# EAGLE design insect-robot (EAGLE 7.7.0)
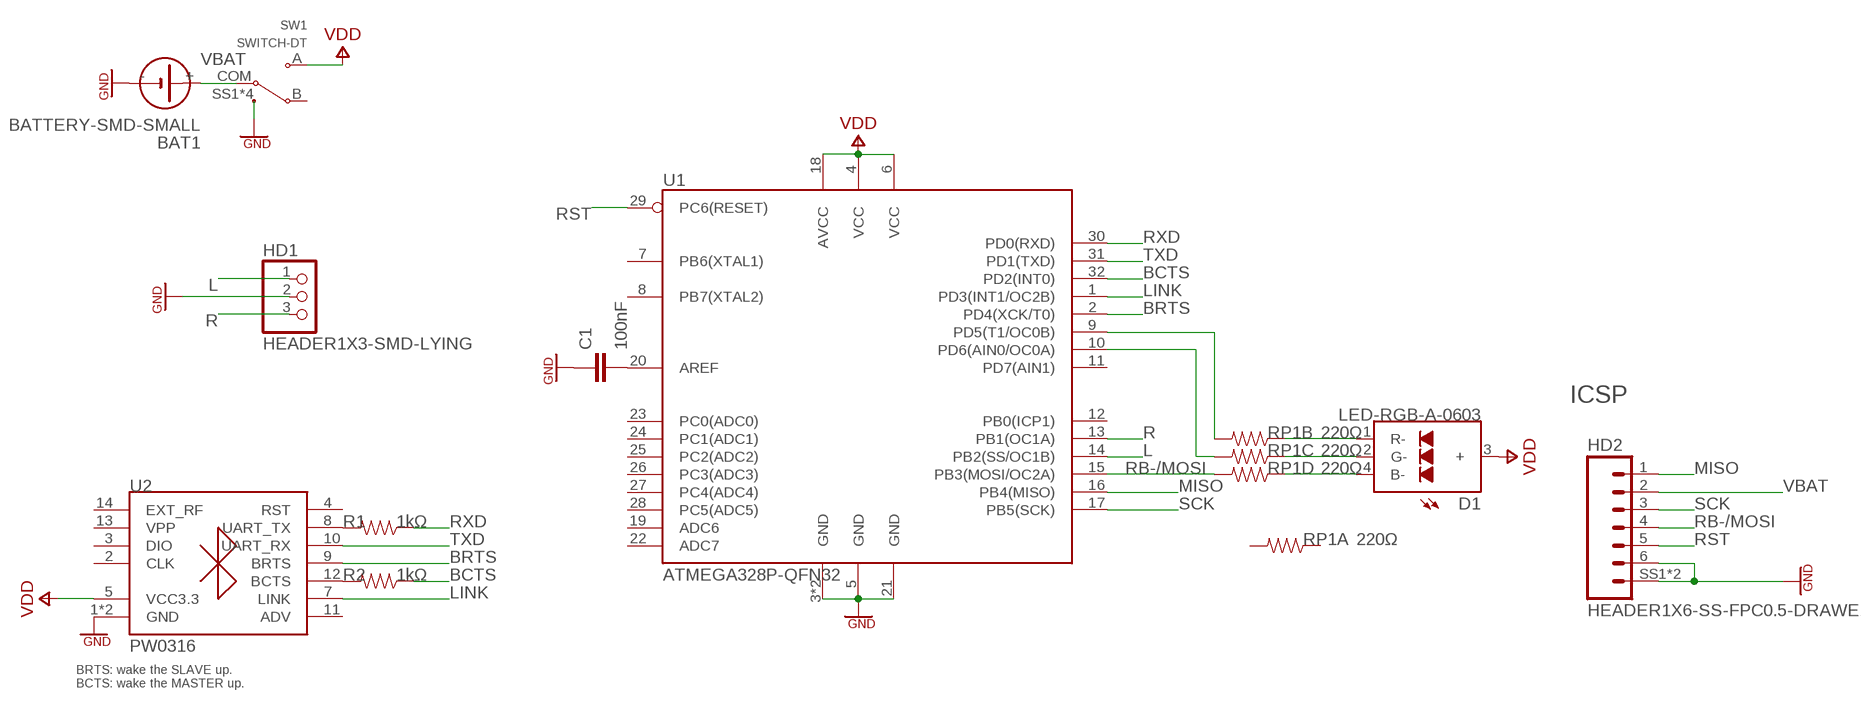
[diagram p0: schematic, sheet 1]

## Parts
BAT1  BATTERY-SMD-SMALL  [BAT-SMD-SMALL]
C1  100nF  CAP-0603  [SMD0603]
D1  LED-RGB-A-0603  [LED-0603X2]
HD1  HEADER1X3-SMD-LYING  [SMD-1X3-LYING]
HD2  HEADER1X6-SS-FPC0.5-DRAWER  [FPC0.5-6-DRAWER]
R1  1kΩ  RES-0603  [SMD0603]
R2  1kΩ  RES-0603  [SMD0603]
RP1  220Ω  RP-0603  [RP0603]
SW1  SWITCH-DT  [SWITCH-SMD-6.7X2.7]
U1  ATMEGA328P-QFN32  [QFN32]
U2  PW0316  [PW0316]

## Nets
AREF: C1.2 U1.20(AREF)
B-: D1.4(B-) RP1.7
BCTS: R2.1 U1.32(PD2(INT0))
BRTS: U1.2(PD4(XCK/T0)) U2.9(BRTS)
G-: D1.2(G-) RP1.5
GND: BAT1.- C1.1 HD1.2 HD2.6 HD2.SS1 HD2.SS2 SW1.SS1(SS) SW1.SS2(SS) SW1.SS3(SS) SW1.SS4(SS) U1.3(GND) U1.5(GND) U1.21(GND) U1.EP(GND) U2.1(GND) U2.6(GND)
L: HD1.1 U1.14(PB2(SS/OC1B))
LINK: U1.1(PD3(INT1/OC2B)) U2.7(LINK)
MISO: HD2.1 U1.16(PB4(MISO))
R: HD1.3 U1.13(PB1(OC1A))
R-: D1.1(R-) RP1.3
R-BCTS: R2.2 U2.12(BCTS)
R-TX: R1.2 U2.8(UART_TX)
RB-/MOSI: HD2.4 RP1.8 U1.15(PB3(MOSI/OC2A))
RG-: RP1.6 U1.10(PD6(AIN0/OC0A))
RR-: RP1.4 U1.9(PD5(T1/OC0B))
RST: HD2.5 U1.29(PC6(RESET))
RXD: R1.1 U1.30(PD0(RXD))
SCK: HD2.3 U1.17(PB5(SCK))
TXD: U1.31(PD1(TXD)) U2.10(UART_RX)
VBAT: BAT1.+ HD2.2 SW1.COM
VDD: D1.3(+) SW1.A U1.4(VCC) U1.6(VCC) U1.18(AVCC) U2.5(VCC3.3)
Unconnected: RP1.1 RP1.2 SW1.B U1.7(PB6(XTAL1)) U1.8(PB7(XTAL2)) U1.11(PD7(AIN1)) U1.12(PB0(ICP1)) U1.19(ADC6) U1.22(ADC7) U1.23(PC0(ADC0)) U1.24(PC1(ADC1)) U1.25(PC2(ADC2)) U1.26(PC3(ADC3)) U1.27(PC4(ADC4)) U1.28(PC5(ADC5)) U2.2(CLK) U2.3(DIO) U2.4(RST) U2.11(ADV) U2.13(VPP) U2.14(EXT_RF)

## Notes on the sheet
- ICSP
- BRTS: wake the SLAVE up.
  BCTS: wake the MASTER up.

## Library data of the parts
BAT1 = MyLibrary:BATTERY: Battery port
C1 = MyLibrary:CAP: Non-polarized capacitor
D1 = MyLibrary:LED-RGB-A: Common Anode
HD1 = MyLibrary:HEADER1X3
HD2 = MyLibrary:HEADER1X6-SS: 6-pin Header (1*6) 0.5mm Pitch Connectors For FPC/FFC
R1 R2 = MyLibrary:RES: Resistor
RP1 = MyLibrary:RP: Resistor Packs
SW1 = MyLibrary:SWITCH-DT
U1 = MyLibrary:ATMEGA328P: Atmel 32-pin 8-bit AVR microcontroller
U2 = MyLibrary:PW0316: BCTS: data arrived signal, uses for wake up the master; BRTS: data send request, uses for wake up this module.

## Board
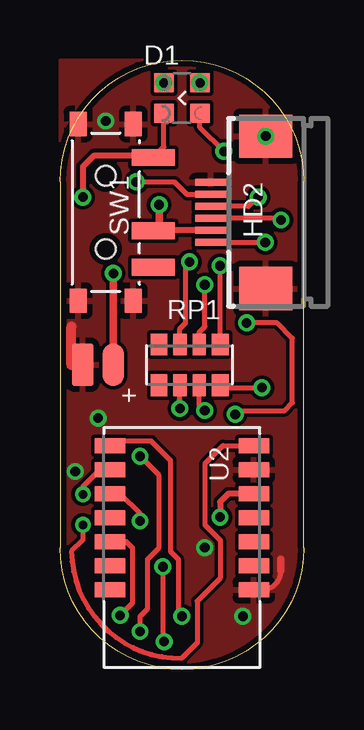
[diagram p1: board, top side]
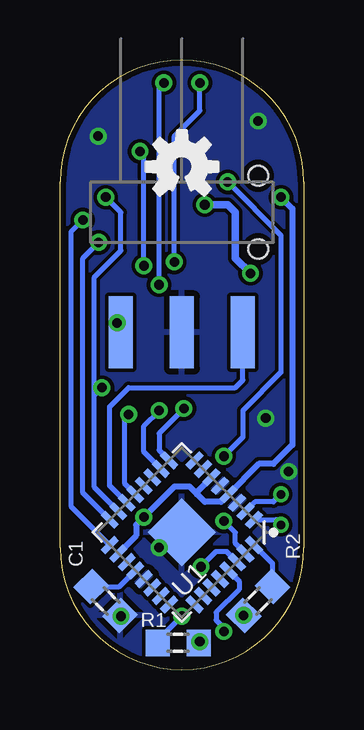
[diagram p2: board, bottom side, seen from below]

Size 10.16 x 25.4 mm. Coordinates in mm from the lower left corner, seen from the top.
Outline: 10.16,5.08 10.16,20.32 arc90 5.08,25.4 arc90 0,20.32 0,5.08 arc90 5.08,0 arc90 10.16,5.08
Copper layers (1*16): Top 0.035mm / dielectric 1.5mm / Bottom 0.035mm
Design rules "seeedStudio": minimum track width 6mil, minimum drill 12mil, track to track 6mil, track to pad 6mil, pad to pad 6mil, via to via 6mil, smd to smd 0mil, copper to edge 10mil, drill to drill 10mil, minimum pad ring 10mil, minimum via ring 6mil, stop-mask expansion 2mil, vias tented up to drill 100mil, thermal gap 10mil

### Footprints (pad centres in the part's own frame; a part is rotated, then mirrored left to right if it is on the bottom)
BAT-SMD-SMALL = smd 0.889 x 1.778: + 0.635,0; - -0.635,0
SMD0603 = smd 1 x 1.1: 1 -0.85,0; 2 0.85,0
LED-0603X2 = smd 0.8 x 0.8: 1 0.635,0.75; 2 0.635,-0.75; 3 -0.635,0.75; 4 -0.635,-0.75
SMD-1X3-LYING = smd 1 x 3: 1 -6.35,5; 2 -3.81,5; 3 -1.27,5
FPC0.5-6-DRAWER = smd 0.3 x 1.3: 1 -1.25,3.25; 2 -0.75,3.25; 3 -0.25,3.25; 4 0.25,3.25; 5 0.75,3.25; 6 1.25,3.25 | smd 1.8 x 2.2: SS1 -3.175,0.953; SS2 3.175,0.953
RP0603 = smd 0.7 x 0.9: 1 -1.275,0.85; 2 -1.275,-0.85; 7 1.275,0.85; 8 1.275,-0.85 | smd 0.55 x 0.9: 3 -0.4,0.85; 4 -0.4,-0.85; 5 0.4,0.85; 6 0.4,-0.85
SWITCH-SMD-6.7X2.7 = smd 1.8 x 0.7: A 1.978,2.286; B 1.978,-2.286; COM 1.978,-0.762 | smd 0.7 x 1.016: SS1 -1.15,-3.683; SS2 1.15,-3.683; SS3 1.15,3.683; SS4 -1.15,3.683 | hole 0.813: 0,-1.524; 0,1.524
QFN32 = smd 0.8 x 0.285: 1 -2.5,1.75; 2 -2.5,1.25; 3 -2.5,0.75; 4 -2.5,0.25; 5 -2.5,-0.25; 6 -2.5,-0.75; 7 -2.5,-1.25; 8 -2.5,-1.75; 17 2.5,-1.75; 18 2.5,-1.25; 19 2.5,-0.75; 20 2.5,-0.25; 21 2.5,0.25; 22 2.5,0.75; 23 2.5,1.25; 24 2.5,1.75 | smd 0.285 x 0.8: 9 -1.75,-2.5; 10 -1.25,-2.5; 11 -0.75,-2.5; 12 -0.25,-2.5; 13 0.25,-2.5; 14 0.75,-2.5; 15 1.25,-2.5; 16 1.75,-2.5; 25 1.75,2.5; 26 1.25,2.5; 27 0.75,2.5; 28 0.25,2.5; 29 -0.25,2.5; 30 -0.75,2.5; 31 -1.25,2.5; 32 -1.75,2.5 | smd 2 x 2: EP 0,0
PW0316 = smd 1.27 x 0.635: 1 -3,1.75; 2 -3,0.75; 3 -3,-0.25; 4 -3,-1.25; 5 -3,-2.25; 6 -3,-3.25; 7 -3,-4.25; 8 3,-4.25; 9 3,-3.25; 10 3,-2.25; 11 3,-1.25; 12 3,-0.25; 13 3,0.75; 14 3,1.75

### Placement (x,y rotation side)
BAT1  1.59,12.7 0 top
C1  8.26,2.86 135 bottom
D1  5.08,23.81 90 top
HD1  8.89,19.05 180 bottom
HD2  9.53,19.05 90 top
OSHW  [ICON-OSHW]  5.08,20.95 0 bottom
R1  5.24,1.11 180 bottom
R2  1.91,2.86 225 bottom
RP1  5.4,12.7 0 top
SW1  1.91,19.05 0 top
U1  5.08,5.71 225 bottom
U2  5.08,5.08 180 top

### Tracks (layer width: path | path; a pad name or v marks a point on that pad's centre or on a via)
AREF
  Bottom 0.203: C1.2 7.69,3.46 U1.20
B-  (via drill 0.4)
  Top 0.203: RP1.7 v6.67,16.83 | v6.83,21.59 5.83,22.59 D1.4
  Bottom 0.203: v6.67,16.83 6.67,21.43 v6.83,21.59
BCTS
  Bottom 0.203: R2.1 1.3,4.41 U1.32
BRTS  (via drill 0.35)
  Top 0.203: v0.95,7.3 0.95,7.62 1.59,8.26 2,8.26 U2.9
  Bottom 0.203: v0.95,7.3 1.27,6.99 2.04,6.99 U1.2
G-  (via drill 0.4)
  Top 0.203: RP1.5 5.8,14.05 6.03,14.29 v6.03,16.03
  Bottom 0.203: v6.03,16.03 6.03,24.25 D1.2
  other vias: 5.83,24.45
GND  (via drill 0.4 pad 0.25)
  Top 0.203: 8.41,3.33 8.57,3.49 | U2.1 8.41,3.33 | 8.41,3.33 arc90 9.21,4.13
  Top 0.305: 9.21,4.13 9.21,4.6
  Top 0.406: BAT1.- 0.48,12.7 0.48,14.29
  Bottom 0.203: U1.21 6.71,3.77 | v7.62,2.22 C1.1
  other vias: 8.57,22.23 1.91,22.86 6.03,5.08 1.59,10.48 0.64,8.26
  pour Top: 0,0 0,25.4 10.16,25.4 10.16,0
  pour Bottom: 0,0 0,25.4 10.16,25.4 10.16,0
L
  Bottom 0.203: HD1.1 2.54,12.06 2.86,11.75 7.3,11.75 8.1,10.95 8.1,7.67 U1.14
LINK  (via drill 0.35 pad 0.25)
  Top 0.203: 8.45,9.33 U2.7 6.79,9.33 6.03,8.57 6.03,6.03 6.67,5.4 6.67,3.81 5.71,2.86 5.71,1.11 5.08,0.48 arc-90 0.48,4.92 0.95,5.4 v0.95,6.03
  Bottom 0.203: U1.1 1.17,6.25 v0.95,6.03
MISO  (via drill 0.4)
  Top 0.203: HD2.1 v8.55,17.8
  Bottom 0.203: U1.16 9.21,7.37 9.21,17.14 v8.55,17.8
R  (via drill 0.4)
  Top 0.203: v7.78,14.45 9.05,14.45 9.68,13.81 9.68,11.11 9.37,10.79 7.46,10.79 v7.3,10.64
  Bottom 0.203: v7.78,14.45 7.62,14.29 HD1.3 | U1.13 7.46,7.74 7.46,10.48 v7.3,10.64
R-  (via drill 0.4)
  Top 0.203: RP1.3 5,14.21 5.24,14.45 5.24,16.83 v5.4,16.99
  Bottom 0.203: v5.4,16.99 5.4,22.23 4.33,23.29 D1.1
  other vias: 4.33,24.45
R-BCTS  (via drill 0.4)
  Top 0.203: U2.12 2.77,5.33 3.02,5.08 3.02,2.77 R2.2
  other vias: 2.51,2.26
R-TX  (via drill 0.4)
  Top 0.203: v5.08,2.22 4.92,2.38 4.92,4.6 4.6,4.92 4.6,8.73 3.81,9.53 2.27,9.53 U2.8
  Bottom 0.203: 5.93,1.37 R1.2 6.09,1.21 v5.08,2.22
RB-/MOSI  (via drill 0.4, 0.4 pad 0.25)
  Top 0.203: HD2.4 7.85,19.3 8.23,19.68 v8.26,19.68 | RP1.8 6.78,11.75 v8.41,11.75
  Bottom 0.203: U1.15 8.73,7.6 8.73,11.43 | v8.26,19.68 7.62,19.05 7.62,17.46 8.73,16.35 8.73,11.43 | v8.41,11.75 8.73,11.43
RG-  (via drill 0.4)
  Top 0.203: RP1.6 5.8,11.03 v6.03,10.79
  Bottom 0.203: U1.10 6.67,9.07 6.67,10.16 v6.03,10.79
RR-  (via drill 0.4)
  Top 0.203: v5,10.88 RP1.4
  Bottom 0.203: v5,10.88 6.03,9.84 6.03,9.14 U1.9
RST  (via drill 0.4)
  Top 0.203: v3.33,1.59 3.33,2.22 3.65,2.54 3.65,4.6 4.13,5.08 4.13,8.1 v3.33,8.89 | v3.17,20.32 4.76,20.32 5.28,19.8 HD2.5
  Bottom 0.203: U1.29 2.7,3.69 2.7,3.33 3.65,2.38 3.65,2.06 3.33,1.75 v3.33,1.59 | v3.17,20.32 0.95,18.1 0.95,12.38 2.54,10.79 2.54,9.68 v3.33,8.89
RXD  (via drill 0.4)
  Top 0.203: R1.1 v4.34,1.16 4.29,1.21 v4.29,4.29
  Bottom 0.203: U1.30 3.23,4.92 3.65,4.92 v4.29,4.29 | R1.1 v4.34,1.16
SCK  (via drill 0.4 pad 0.25)
  Top 0.203: v9.21,18.73 9.14,18.8 HD2.3
  Bottom 0.203: 8.19,5.08 U1.17 9.68,6.78 9.68,18.26 v9.21,18.73
TXD  (via drill 0.4)
  Top 0.203: U2.10 2.51,7.33 3.33,6.51 v3.33,6.19
  Bottom 0.203: U1.31 2.86,5.26 2.86,5.71 v3.33,6.19
VBAT  (via drill 0.4)
  Top 0.254: HD2.2 3.9,18.3 SW1.COM
  Top 0.305: BAT1.+ v2.22,16.51 | v4.13,19.37 4.13,18.53 SW1.COM
  Bottom 0.305: v2.22,16.51 2.86,17.14 2.86,19.05 3.17,19.37 v4.13,19.37
VDD  (via drill 0.4)
  Top 0.203: 3.95,21.27 SW1.A 4.33,21.78 D1.3
  Top 0.254: U2.5 7.01,7.33 6.67,6.99 v6.67,6.35 | SW1.A 3.79,21.43 1.43,21.43 0.95,20.95 v0.95,19.68
  Top 0.305: U2.5 8.05,7.3
  Bottom 0.254: U1.18 6.99,5.58 6.99,6.03 v6.67,6.35 5.4,7.62 4.76,7.62 4.45,7.3 | 4.45,7.3 4.13,6.99 3.46,6.99 U1.4 1.87,8.57 1.27,8.57 0.48,9.37 0.48,19.21 v0.95,19.68 | U1.6 4.45,7.41 4.45,7.3